# Altium project DS137-1.0-C二氧化硫传感器.PrjPcb
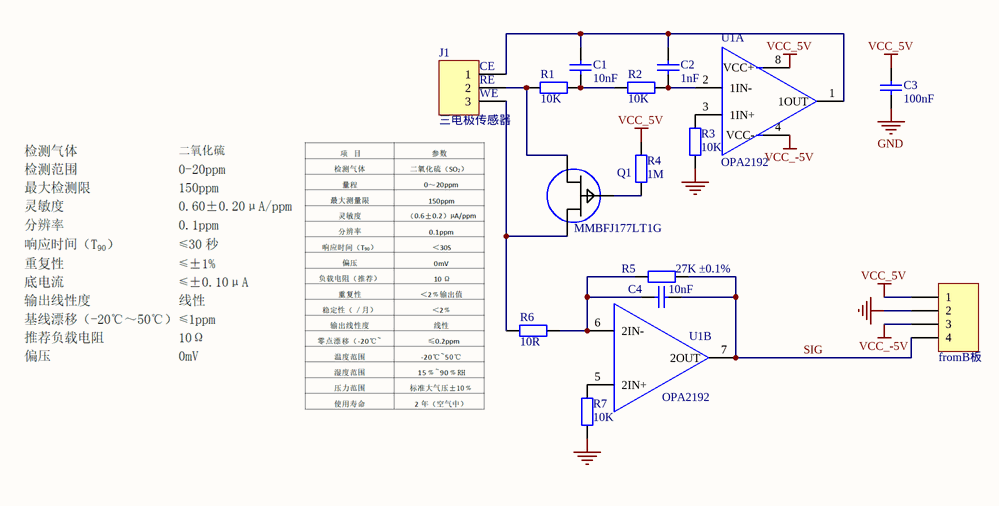
[diagram p0: DS137-1.0-C二氧化硫传感器.SchDoc]
1 sheet, 15 parts. Net scope: global (net labels, ports and power ports of the same name join across sheets).
Board file: DS137-1.0-C二氧化硫传感器.PcbDoc

## Sheet DS137-1.0-C二氧化硫传感器.SchDoc
size A4; SheetNumber: 1; SheetTotal: 1

### Parts
C1  value 10nF  [0603CAP]  (hidden comment: SMDCAP00010)
C2  value 1nF  [0603CAP]  (hidden comment: SMDCAP00008)
C3  value 100nF  [0603CAP]  (hidden comment: SMDCAP00013)
C4  value 10nF  [0603CAP]  (hidden comment: SMDCAP00010)
J1  value 三电极传感器  [3_Electrode]  (hidden comment: SL000000042)
J?  value fromB板  [XH2.54-4PW]  (hidden comment: SL000000034)
Q1  MMBFJ177LT1G  [SOT23]
R1  value 10K  [0603RES]  (hidden comment: SMDRES00056)
R2  value 10K  [0603RES]  (hidden comment: SMDRES00056)
R3  value 10K  [0603RES]  (hidden comment: SMDRES00056)
R4  value 1M  [0603RES]  (hidden comment: SMDRES00085)
R5  value 27K ±0.1%  [0603RES]  (hidden comment: Chip 27K 1/10W ±0.1％ 0603)
R6  value 10R  [0603RES]  (hidden comment: SMDRES00005)
R7  value 10K  [0603RES]  (hidden comment: SMDRES00056)
U1  OPA2192  [SO-8]  (parts A,B of 2)

### Nets
GND: C3.1 J?.2 R3.1 R7.1
VCC_5V: C3.2 J?.1 R4.2 U1.8(VCC+)
VCC_-5V: J?.3 U1.4(VCC-)
SIG: C4.1 J?.4 R5.2 U1.7(2OUT)
NetC1_1: C1.1 R1.2 R2.1
NetC1_2: C1.2 C2.2 J1.1 U1.1(1OUT)
NetC2_1: C2.1 R2.2 U1.2(1IN-)
NetC4_2: C4.2 R5.1 R6.2 U1.6(2IN-)
NetJ1_2: J1.2 Q1.1(D) R1.1
NetJ1_3: J1.3 Q1.2(S) R6.1
NetQ1_3: Q1.3(G) R4.1
NetR3_2: R3.2 U1.3(1IN+)
NetR7_2: R7.2 U1.5(2IN+)

### Notes on the sheet
- (near J1) CE
- (near J1) RE
- (near J1) WE

### Library data of the parts
C1 C4 = MLCC 10nF 50V ±10％ 0603: 贴片电容
C2 = MLCC 1nF 50V ±10％ 0603: 贴片电容
C3 = MLCC 100nF 50V ±10％ 0603: 贴片电容
J1 = DIP3 单排直针 间距2.54mm 针长11mm 铜: 单排直针
J? = XH2.54mm-4AW 弯针座: 4P弯针座
Q1 = J177: P沟道JFET 结型场效应管(JFET) 适用于模拟开关和斩波器应用。
R1-R3 R7 = Chip 10K 1/16W ±1％ 0603: 贴片电阻
R4 = Chip 1M 1/16W ±1％ 0603: 贴片电阻
R6 = Chip 10R 1/16W ±1％ 0603: 贴片电阻
U1 = TL062C